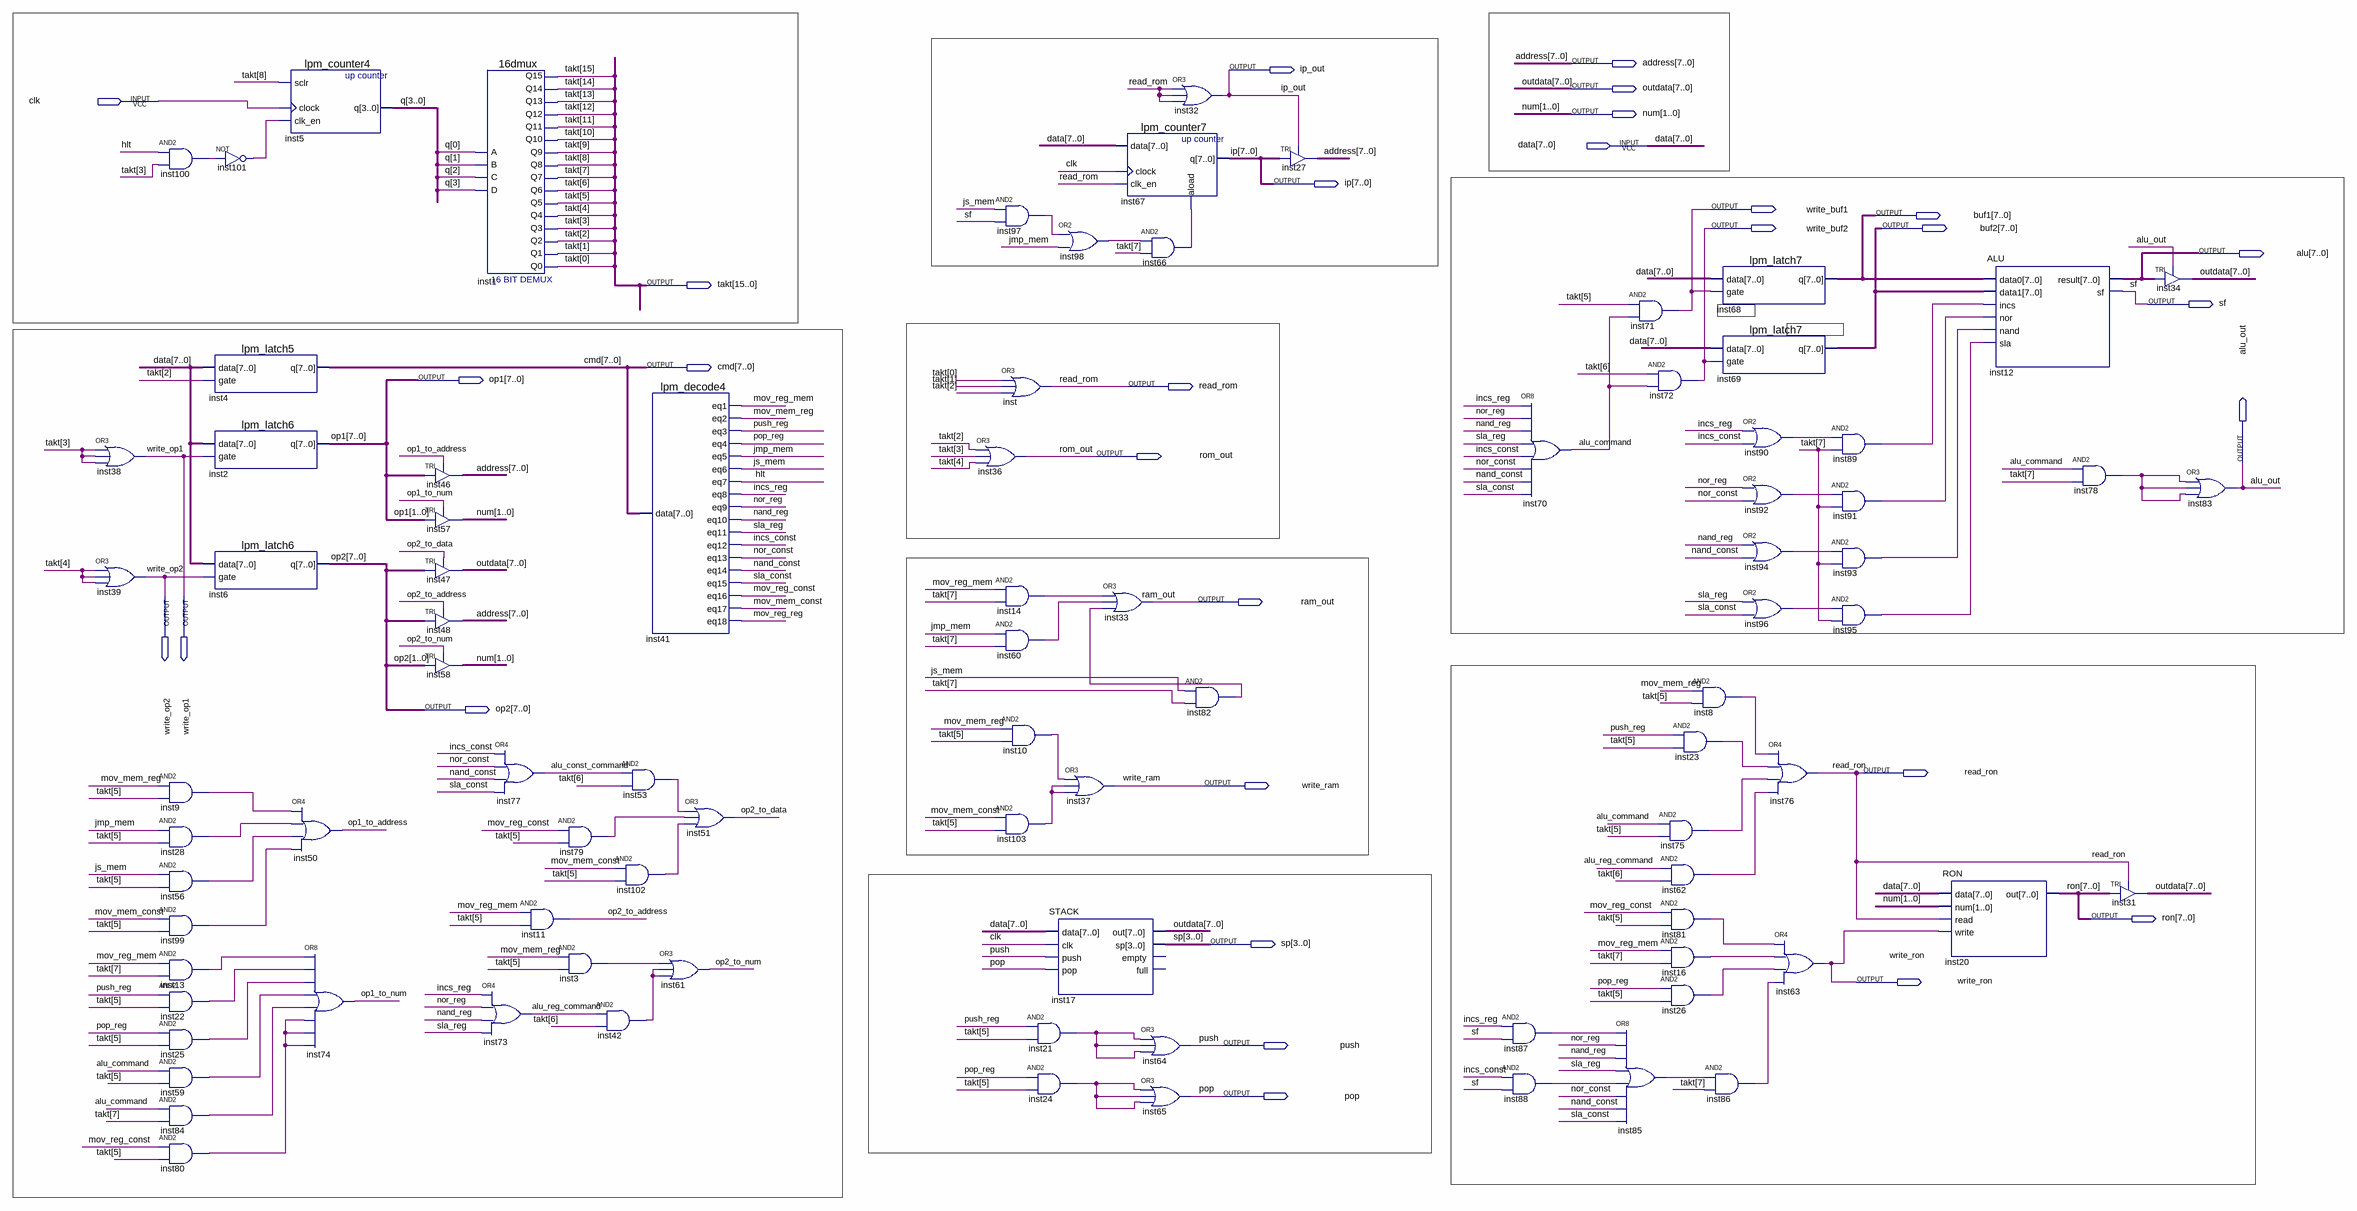
[diagram p0: schematic sheet]
// Quartus schematic CU.bdf as structural Verilog: 89 symbols, 30 pins
module CU (
  input  clk,
  input  [7:0] data,
  output [7:0] address,
  output ip_out,
  output [7:0] outdata,
  output [1:0] num,
  output [7:0] ip,
  output write_buf1,
  output [7:0] buf1,
  output write_buf2,
  output [7:0] buf2,
  output [7:0] alu,
  output [15:0] takt,
  output sf,
  output [7:0] cmd,
  output [7:0] op1,
  output read_rom,
  output rom_out,
  output alu_out,
  output write_op2,
  output write_op1,
  output ram_out,
  output [7:0] op2,
  output read_ron,
  output write_ram,
  output [7:0] ron,
  output [3:0] sp,
  output write_ron,
  output push,
  output pop
);

  wire alu_command, alu_const_command, alu_reg_command, hlt, incs_const, incs_reg, inst3_out, inst8_out,
       inst9_out, inst10_out, inst13_out, inst14_out, inst16_out, inst21_out, inst22_out, inst23_out,
       inst24_out, inst25_out, inst26_out, inst28_out, inst42_out, inst53_out, inst56_out, inst59_out,
       inst60_out, inst62_out, inst66_out, inst75_out, inst78_out, inst79_out, inst80_out, inst81_out,
       inst82_out, inst84_out, inst85_out, inst86_out, inst87_out, inst88_out, inst89_out, inst90_out,
       inst91_out, inst92_out, inst93_out, inst94_out, inst95_out, inst96_out, inst97_out, inst98_out,
       inst99_out, inst100_out, inst101_out, inst102_out, inst103_out, jmp_mem, js_mem, mov_mem_const,
       mov_mem_reg, mov_reg_const, mov_reg_mem, mov_reg_reg, nand_const, nand_reg, nor_const, nor_reg,
       op1_to_address, op1_to_num, op2_to_address, op2_to_data, op2_to_num, pop_reg, push_reg, sla_const,
       sla_reg;
  wire [3:0] q;

  or inst38 (write_op1, takt[3], takt[3], takt[3]);
  or inst39 (write_op2, takt[4], takt[4], takt[4]);
  and inst100 (inst100_out, hlt, takt[3]);
  and inst9 (inst9_out, mov_mem_reg, takt[5]);
  and inst28 (inst28_out, jmp_mem, takt[5]);
  and inst56 (inst56_out, js_mem, takt[5]);
  and inst99 (inst99_out, mov_mem_const, takt[5]);
  and inst13 (inst13_out, mov_reg_mem, takt[7]);
  and inst22 (inst22_out, push_reg, takt[5]);
  and inst25 (inst25_out, pop_reg, takt[5]);
  and inst59 (inst59_out, alu_command, takt[5]);
  and inst84 (inst84_out, alu_command, takt[7]);
  and inst80 (inst80_out, mov_reg_const, takt[5]);
  not inst101 (inst101_out, inst100_out);
  lpm_latch5 inst4 (.data(data), .gate(takt[2]), .q(cmd));
  lpm_latch6 inst2 (.data(data), .gate(write_op1), .q(op1));
  lpm_latch6 inst6 (.data(data), .gate(write_op2), .q(op2));
  lpm_counter4 inst5 (.sclr(takt[8]), .clock(clk), .clk_en(inst101_out), .q(q));
  or inst50 (op1_to_address, inst9_out, inst28_out, inst56_out, inst99_out);
  or inst74 (op1_to_num, inst13_out, inst22_out, inst25_out, inst59_out, inst84_out, inst80_out, inst80_out, inst80_out);
  TRI inst46[7:0] (.IN(op1), .OE(op1_to_address), .OUT(address));
  TRI inst57[1:0] (.IN(op1[1:0]), .OE(op1_to_num), .OUT(num));
  TRI inst47[7:0] (.IN(op2), .OE(op2_to_data), .OUT(outdata));
  TRI inst48[7:0] (.IN(op2), .OE(op2_to_address), .OUT(address));
  TRI inst58[1:0] (.IN(op2[1:0]), .OE(op2_to_num), .OUT(num));
  \16dmux  inst1 (
    .C(q[2]), .B(q[1]), .A(q[0]), .D(q[3]), .Q12(takt[12]), .Q13(takt[13]), .Q11(takt[11]), .Q9(takt[9]),
    .Q10(takt[10]), .Q7(takt[7]), .Q8(takt[8]), .Q4(takt[4]), .Q5(takt[5]), .Q6(takt[6]), .Q2(takt[2]),
    .Q3(takt[3]), .Q14(takt[14]), .Q15(takt[15]), .Q0(takt[0]), .Q1(takt[1]));
  or inst77 (alu_const_command, incs_const, nor_const, nand_const, sla_const);
  and inst11 (op2_to_address, mov_reg_mem, takt[5]);
  or inst73 (alu_reg_command, incs_reg, nor_reg, nand_reg, sla_reg);
  and inst79 (inst79_out, mov_reg_const, takt[5]);
  and inst3 (inst3_out, mov_mem_reg, takt[5]);
  and inst53 (inst53_out, alu_const_command, takt[6]);
  and inst102 (inst102_out, mov_mem_const, takt[5]);
  and inst42 (inst42_out, alu_reg_command, takt[6]);
  lpm_decode4 inst41 (
    .data(cmd), .eq1(mov_reg_mem), .eq2(mov_mem_reg), .eq3(push_reg), .eq4(pop_reg), .eq5(jmp_mem),
    .eq6(js_mem), .eq7(hlt), .eq8(incs_reg), .eq9(nor_reg), .eq10(nand_reg), .eq11(sla_reg),
    .eq12(incs_const), .eq13(nor_const), .eq14(nand_const), .eq15(sla_const), .eq16(mov_reg_const),
    .eq17(mov_mem_const), .eq18(mov_reg_reg));
  or inst61 (op2_to_num, inst3_out, inst42_out, inst42_out);
  or inst51 (op2_to_data, inst53_out, inst79_out, inst102_out);
  or inst36 (rom_out, takt[2], takt[3], takt[4]);
  and inst97 (inst97_out, js_mem, sf);
  or inst (read_rom, takt[0], takt[1], takt[2]);
  and inst14 (inst14_out, mov_reg_mem, takt[7]);
  and inst60 (inst60_out, jmp_mem, takt[7]);
  and inst10 (inst10_out, mov_mem_reg, takt[5]);
  and inst103 (inst103_out, mov_mem_const, takt[5]);
  and inst21 (inst21_out, push_reg, takt[5]);
  and inst24 (inst24_out, pop_reg, takt[5]);
  or inst98 (inst98_out, inst97_out, jmp_mem);
  or inst37 (write_ram, inst10_out, inst103_out, inst103_out);
  STACK inst17 (.data(data), .clk(clk), .push(push), .pop(pop), .out(outdata), .sp(sp));  // open: empty, full
  lpm_counter7 inst67 (.data(data), .clock(clk), .clk_en(read_rom), .aload(inst66_out), .q(ip));
  or inst33 (ram_out, inst14_out, inst60_out, inst82_out);
  or inst32 (ip_out, read_rom, read_rom, read_rom);
  and inst66 (inst66_out, inst98_out, takt[7]);
  or inst64 (push, inst21_out, inst21_out, inst21_out);
  or inst65 (pop, inst24_out, inst24_out, inst24_out);
  and inst82 (inst82_out, js_mem, takt[7]);
  TRI inst27[7:0] (.IN(ip), .OE(ip_out), .OUT(address));
  or inst70 (alu_command, incs_reg, nor_reg, nand_reg, sla_reg, incs_const, nor_const, nand_const, sla_const);
  and inst87 (inst87_out, incs_reg, sf);
  and inst88 (inst88_out, incs_const, sf);
  and inst71 (write_buf1, takt[5], alu_command);
  or inst85 (inst85_out, inst87_out, nor_reg, nand_reg, sla_reg, inst88_out, nor_const, nand_const, sla_const);
  and inst72 (write_buf2, takt[6], alu_command);
  and inst23 (inst23_out, push_reg, takt[5]);
  and inst75 (inst75_out, alu_command, takt[5]);
  and inst62 (inst62_out, alu_reg_command, takt[6]);
  and inst81 (inst81_out, mov_reg_const, takt[5]);
  and inst16 (inst16_out, mov_reg_mem, takt[7]);
  and inst26 (inst26_out, pop_reg, takt[5]);
  lpm_latch7 inst68 (.data(data), .gate(write_buf1), .q(buf1));
  lpm_latch7 inst69 (.data(data), .gate(write_buf2), .q(buf2));
  and inst8 (inst8_out, mov_mem_reg, takt[5]);
  and inst86 (inst86_out, inst85_out, takt[7]);
  or inst90 (inst90_out, incs_reg, incs_const);
  or inst92 (inst92_out, nor_reg, nor_const);
  or inst94 (inst94_out, nand_reg, nand_const);
  or inst96 (inst96_out, sla_reg, sla_const);
  or inst76 (read_ron, inst8_out, inst23_out, inst75_out, inst62_out);
  or inst63 (write_ron, inst81_out, inst16_out, inst26_out, inst86_out);
  and inst89 (inst89_out, inst90_out, takt[7]);
  and inst91 (inst91_out, inst92_out, takt[7]);
  and inst93 (inst93_out, inst94_out, takt[7]);
  and inst95 (inst95_out, inst96_out, takt[7]);
  RON inst20 (.data(data), .num(num), .read(read_ron), .write(write_ron), .out(ron));
  ALU inst12 (
    .data0(buf1), .data1(buf2), .incs(inst89_out), .\nor (inst91_out), .\nand (inst93_out), .sla(inst95_out),
    .result(alu), .sf(sf));
  and inst78 (inst78_out, alu_command, takt[7]);
  TRI inst31[7:0] (.IN(ron), .OE(read_ron), .OUT(outdata));
  TRI inst34[7:0] (.IN(alu), .OE(alu_out), .OUT(outdata));
  or inst83 (alu_out, inst78_out, inst78_out, inst78_out);
endmodule
